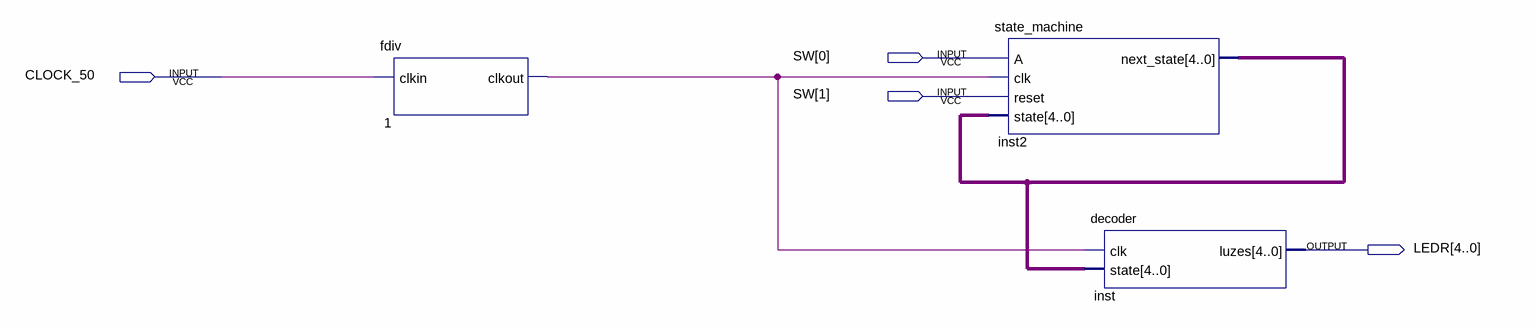
[diagram p0: schematic sheet]
// Quartus schematic semaforo.bdf as structural Verilog: 3 symbols, 4 pins
module semaforo (
  input  [1:0] SW,
  input  CLOCK_50,
  output [4:0] LEDR
);

  wire n1_clkout;
  wire [4:0] inst2_next_state;

  fdiv u_1 (.clkin(CLOCK_50), .clkout(n1_clkout));
  state_machine inst2 (
    .A(SW[0]), .clk(n1_clkout), .reset(SW[1]), .state(inst2_next_state), .next_state(inst2_next_state));
  decoder inst (.clk(n1_clkout), .state(inst2_next_state), .luzes(LEDR));
endmodule
